# Altium schematic sheet Boost 5V.SchDoc
size A; SheetNumber: 12; SheetTotal: 12
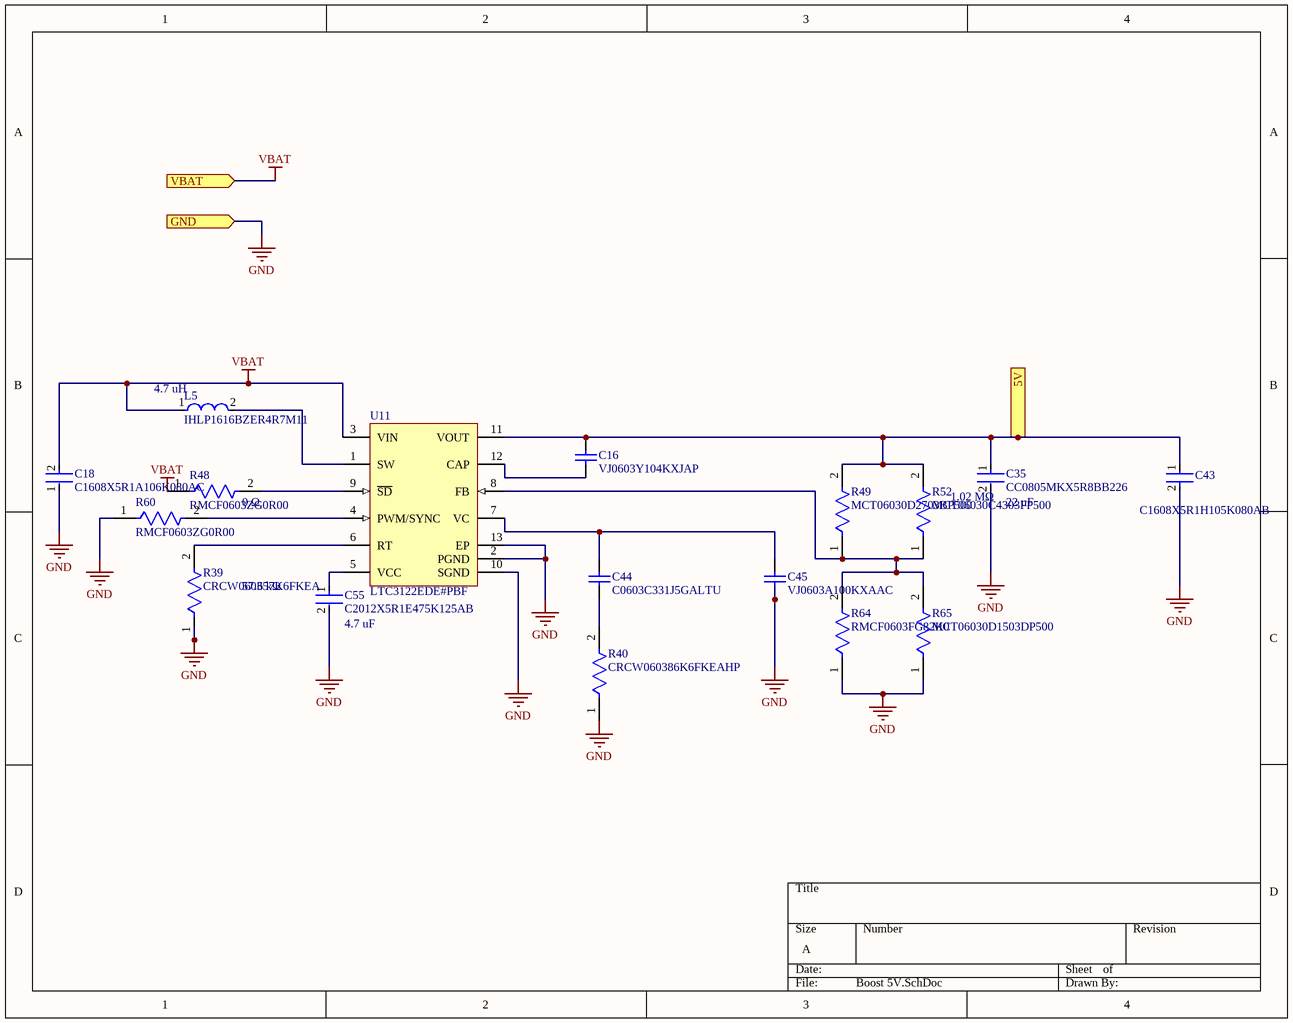
[diagram p0: Boost 5V.SchDoc]

## Parts
C16  VJ0603Y104KXJAP  [CAPC1608X92X38NL15T08]
C18  C1608X5R1A106K080AC  [FP-C1608-080-0_1-MFG]
C35  CC0805MKX5R8BB226  [FP-CC0805-0_2-1_45-IPC_C]
C43  C1608X5R1H105K080AB  [FP-C1608-080-0_1-IPC_B]
C44  C0603C331J5GALTU  [CAPC1608X87X35NL15T15]
C45  VJ0603A100KXAAC  [CAPC1608X92X38ML12T08]
C55  C2012X5R1E475K125AB  [FP-C2012-125-0_2-MFG]
L5  IHLP1616BZER4R7M11  [FP-IHLP-1616BZ-FP_1_8545x-MFG]
R39  CRCW060357K6FKEA  [FP-CRCW0603-e3-MFG]
R40  CRCW060386K6FKEAHP  [FP-CRCW0603-HPe3-MFG]
R48  RMCF0603ZG0R00  [FP-RMCF0603-IPC_B]
R49  MCT06030D2703BP500  [FP-MCT0603-IPC_A]
R52  MCT06030C4303FP500  [FP-MCT0603-IPC_A]
R60  RMCF0603ZG0R00  [FP-RMCF0603-IPC_B]
R64  RMCF0603FG82K0  [FP-RMCF0603-IPC_C]
R65  MCT06030D1503DP500  [FP-MCT0603-IPC_C]
U11  LTC3122EDE#PBF  [LT-DE-UE-12_V]

## Ports
5V (out), GND (in), VBAT (in)

## Nets
GND: C18.1 C35.2 C43.2 C45.1 C55.2 R39.1 R40.1 R60.1 R64.1 R65.1 U11.2(PGND) U11.10(SGND) U11.13(EP) ; port GND
VBAT: C18.2 L5.1 R48.1 U11.3(VIN) ; port VBAT
5V: C16.2 C35.1 C43.1 R49.2 R52.2 U11.11(VOUT) ; port 5V
NetC16_1: C16.1 U11.12(CAP)
NetC44_1: C44.1 R40.2
NetC44_2: C44.2 C45.2 U11.7(VC)
NetC55_1: C55.1 U11.5(VCC)
NetL5_2: L5.2 U11.1(SW)
NetR39_2: R39.2 U11.6(RT)
NetR48_2: R48.2 U11.9(~{SD})
NetR49_1: R49.1 R52.1 R64.2 R65.2 U11.8(FB)
NetR60_2: R60.2 U11.4(PWM/SYNC)

## Notes on the sheet
- (near L5) 4.7 uH
- (near R48) 0 Ω
- (near C35) 1.02 MΩ
- (near C35) 22 uF
- 57.6 kΩ
- (near C55) 4.7 uF

## Library data of the parts
C16 = CMP-2006-01211-1: Manufacturer: Vitramon; Part Number: VJ0603Y104KXJAP
C18 = CMP-2000-04979-3: Multilayer Ceramic Capacitors 10μF ±10% 10V X5R SMD 0603; Capacitance: 10uF; Dielectric Material: Ceramic; Construction: Flat; Height: 0.8mm; Thickness: 0.035inch; Case Code (Metric): 1608; Radiation Hardening: No; Number of Pins: 2; Voltage Rating (DC): 10V; Depth: 0.8mm; Voltage: 10V; RoHS Compliant: Yes; Voltage Rating: 10V; Package Quantity: 1; Resistor Type: Ceramic; Termination: SMD/SMT; Lead Free: Lead Free; REACH SVHC: No SVHC; Tolerance: 10%; Mount: Surface Mount; Series: C; Packaging: Tape and Reel; Width: 0.8mm; Dielectric: X5R; Weight: 7.1E-05oz; Length: 1.6mm; Max Operating Temperature: 85°C; Case Code (Imperial): 0603; Case/Package: 0603; Min Operating Temperature: -55°C
C35 = CMP-03422-001497-1: CAP CER 22UF 25V X5R 0805; Tolerance: 20%; Max Operating Temperature: 85°C; Dielectric: X5R; Termination: SMD/SMT; Voltage Rating: 25V; Width: 0.049inch; Min Operating Temperature: -55°C; Case/Package: 0805; Lead Free: Lead Free; RoHS Compliant: Yes; Weight: 0.000194oz; Voltage Rating (DC): 25V; Capacitance: 22uF; Length: 0.079inch; Halogen Free: Halogen Free; Height: 1.25mm; Packaging: Tape and Reel; Package Quantity: 3000; Case Code (Metric): 2012; Thickness: 0.057inch; Case Code (Imperial): 0805; Mount: Surface Mount
C43 = CMP-2000-06025-2: Multilayer Ceramic Capacitors 1μF ±10% 50V X5R SMD 0603; Capacitance: 1uF; Lead Free: Lead Free; Height: 0.8mm; Mount: Surface Mount; Radiation Hardening: No; Thickness: 0.035inch; Length: 1.6mm; Max Operating Temperature: 85°C; REACH SVHC: No SVHC; Min Operating Temperature: -55°C; Construction: Flat; RoHS Compliant: Yes; Voltage Rating: 50V; Dielectric: X5R; Packaging: Tape and Reel; Termination: SMD/SMT; Voltage Rating (DC): 50V; Case Code (Imperial): 0603; Voltage: 50V; Width: 0.031inch; Weight: 7.1E-05oz; Depth: 0.8mm; Case Code (Metric): 1608; Series: C; Case/Package: 0603; Tolerance: 10%; Resistor Type: Ceramic; Number of Pins: 2; Dielectric Material: Ceramic; Package Quantity: 1
C44 = CMP-2006-03564-1: Manufacturer: Kemet; Part Number: C0603C331J5GALTU
C45 = CMP-2006-02012-1: Manufacturer: Vitramon; Part Number: VJ0603A100KXAAC
C55 = CMP-08246-004908-1: Multilayer Ceramic Capacitors 4.7μF ±10% 25V X5R SMD 0805; Capacitance: 4.7uF; Lead Free: Lead Free; Thickness: 0.057inch; Packaging: Tape and Reel; Min Operating Temperature: -55°C; RoHS Compliant: Yes; Dielectric: X5R; Weight: 0.000194oz; REACH SVHC: No SVHC; Voltage Rating (DC): 25V; Mount: Surface Mount; Resistor Type: Ceramic; Termination: SMD/SMT; Number of Pins: 2; Case Code (Imperial): 0805; Dielectric Material: Ceramic; Voltage: 25V; Voltage Rating: 25V; Case Code (Metric): 2012; Case/Package: 0805; Max Operating Temperature: 85°C; Height: 1.25mm; Tolerance: 10%; Depth: 1.25mm; Package Quantity: 1; Length: 2mm; Radiation Hardening: No; Width: 1.25mm
L5 = CMP-02424-000576-1: Fixed Inductors Commercial Low DCR Series SMT 4.7uH 1.7A 105mΩ 20%; Saturation Current: 1.75A; Test Frequency: 100kHz; Shielding: Shielded; Self Resonant Frequency: 29MHz; Core Material: Ferrite; DC Resistance (DCR): 105mR; Width: 4.06mm; Depth: 4.31mm; Height: 2mm; Inductance: 4.7uH; Case/Package: 1616; Max DC Current: 1.7A; Max Operating Temperature: 125°C; Inductance Tolerance: 20%; Current Rating: 1.7A; Package Quantity: 4000; Tolerance: 20%; Length: 4.7mm; Contact Plating: Tin; RMS Current (Irms): 1.7A; Packaging: Tape and Reel; Height - Seated (Max): 0.079inch; Military Standard: Not; Termination: SMD/SMT; Mount: Surface Mount; Number of Pins: 1616; Min Operating Temperature: -55°C; Lead Free: Lead Free; Radiation Hardening: No
R39 = CMP-2000-03475-2: RES Thick Film, 57.6kΩ, 1%, 0.1W, 100ppm/°C, 0603; Voltage Rating: 75V; Power Rating: 100mW; Resistance: 57.6kR; Case Code (Metric): 1608; Length: 1.55mm; Weight: 7.1E-05oz; Case/Package: 0603; Features: Automotive AEC-Q200; Contact Plating: Tin; Temperature Coefficient: 100ppm/°C; Number of Terminations: 2; Packaging: Tape and Reel; Package Quantity: 10; Max Power Dissipation: 100mW; Depth: 0.85mm; Height: 0.45mm; Tolerance: 1%; Radiation Hardening: No; Composition: Thick Film; Width: 0.85mm; Min Operating Temperature: -55°C; Case Code (Imperial): 0603; Termination: SMD/SMT; Number of Pins: 2; Max Operating Temperature: 155°C; Military Standard: Not
R40 = CMP-02407-006337-1: RES Thick Film, 86.6kΩ, 1%, 0.33W, 100ppm/°C, 0603; Max Power Dissipation: 250mW; Resistance: 86.6kR; Tolerance: 1%; Width: 0.033inch; Package Quantity: 5000; Composition: Thick Film; Number of Terminations: 2; Height: 0.022inch; Length: 0.063inch; Temperature Coefficient: 100ppm/°C; Packaging: Tape and Reel; Features: Automotive AEC-Q200; Lead Free: Lead Free; Case/Package: 0603
R48 R60 = CMP-26527-006412-1: 0Ω ±0 0.1W 0603 Thick Film Chip Resistor AEC-Q200 compliant; Max Power Dissipation: 100mW; Resistance: 0R; Width: 0.031inch; RoHS Compliant: Yes; Number of Terminations: 2; Case/Package: 0603; Contact Plating: Tin; Height: 0.022inch; Resistor Type: Thick Film; Mount: Surface Mount; Length: 0.061inch; Features: Automotive AEC-Q200; Series: RMCF; Max Operating Temperature: 155°C; Radiation Hardening: No; Min Operating Temperature: -55°C; Packaging: Tape and Reel
R49 = CMP-02407-001035-1: RES SMD 100 OHM 1% 1/8W 0603
R52 = CMP-02407-000140-1: RES SMD 100 OHM 1% 1/8W 0603; Temperature Coefficient: 50ppm/°C; Resistance: 430kR; Packaging: Tape and Reel; Min Operating Temperature: -55°C; Depth: 0.85mm; Max Operating Temperature: 125°C; Tolerance: 1%; Case/Package: 0603; Lead Free: Lead Free; Contact Plating: Tin; Radiation Hardening: No; Composition: Thin Film; Length: 1.55mm; Military Standard: Not
R64 = CMP-26527-006203-1: 82kΩ ±1% 0.1W 0603 Thick Film Chip Resistor AEC-Q200 compliant; Max Power Dissipation: 100mW; Resistance: 82kR; Temperature Coefficient: 100ppm/°C; Series: RMCF; Features: Automotive AEC-Q200; Height: 0.022inch; RoHS Compliant: Yes; Radiation Hardening: No; Number of Terminations: 2; Max Operating Temperature: 155°C; Width: 0.031inch; Mount: Surface Mount; Contact Plating: Tin; Packaging: Tape and Reel; Package Quantity: 10000; Resistor Type: Thick Film; Case/Package: 0603; Length: 0.061inch; Min Operating Temperature: -55°C; Tolerance: 1%
R65 = CMP-02407-001306-1: RES SMD 100 OHM 1% 1/8W 0603; Tolerance: 0.5%; Max Power Dissipation: 125mW; Temperature Coefficient: 25ppm/°C; Resistance: 150kR; Packaging: Tape and Reel; Width: 0.033inch; Package Quantity: 5000; Case/Package: 0603; Min Operating Temperature: -55°C; Composition: Thin Film; Max Operating Temperature: 155°C; Number of Terminations: 2; Height: 0.022inch; Lead Free: Lead Free; Length: 0.061inch
U11 = CMP-0492-00369-1: 2.5 A Synchronous Step-Up DC/DC Converter with Output Disconnect, 12-pin SON (DE-UE-12), -40 to 125 degC, Pb-Free; Manufacturer: Linear Technology; Number of Outputs: 1; ComponentLink2URL: http://cds.linear.com/docs/en/datasheet/3122fa.pdf; ComponentLink1URL: http://www.linear.com/; Code_JEDEC: MO-229; ComponentLink2Description: Datasheet; ComponentLink1Description: Manufacturer URL; PackageReference: DE-UE-12; PackageVersion: Rev. D, 06/2010; ComponentLink3Description: Package Specification; PackageDescription: 12-Pin Plastic DFN, Body 4 x 3 mm, Pitch 0.5 mm; PartNumber: LTC3122EDE#PBF; ComponentLink3URL: http://cds.linear.com/docs/en/packaging/DFN_12_05-08-1695.pdf; Mounting Technology: Surface Mount; RoHS: TRUE; DatasheetVersion: Rev. A